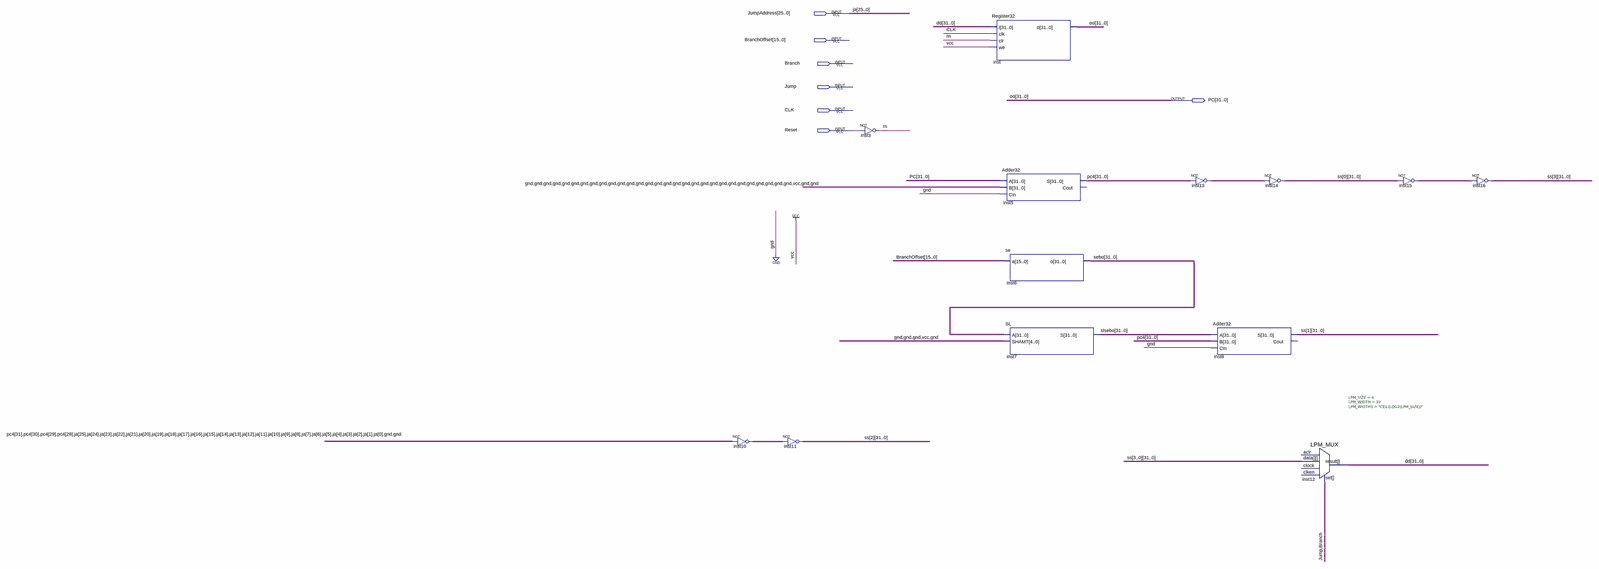
[diagram p0: schematic sheet, whole]
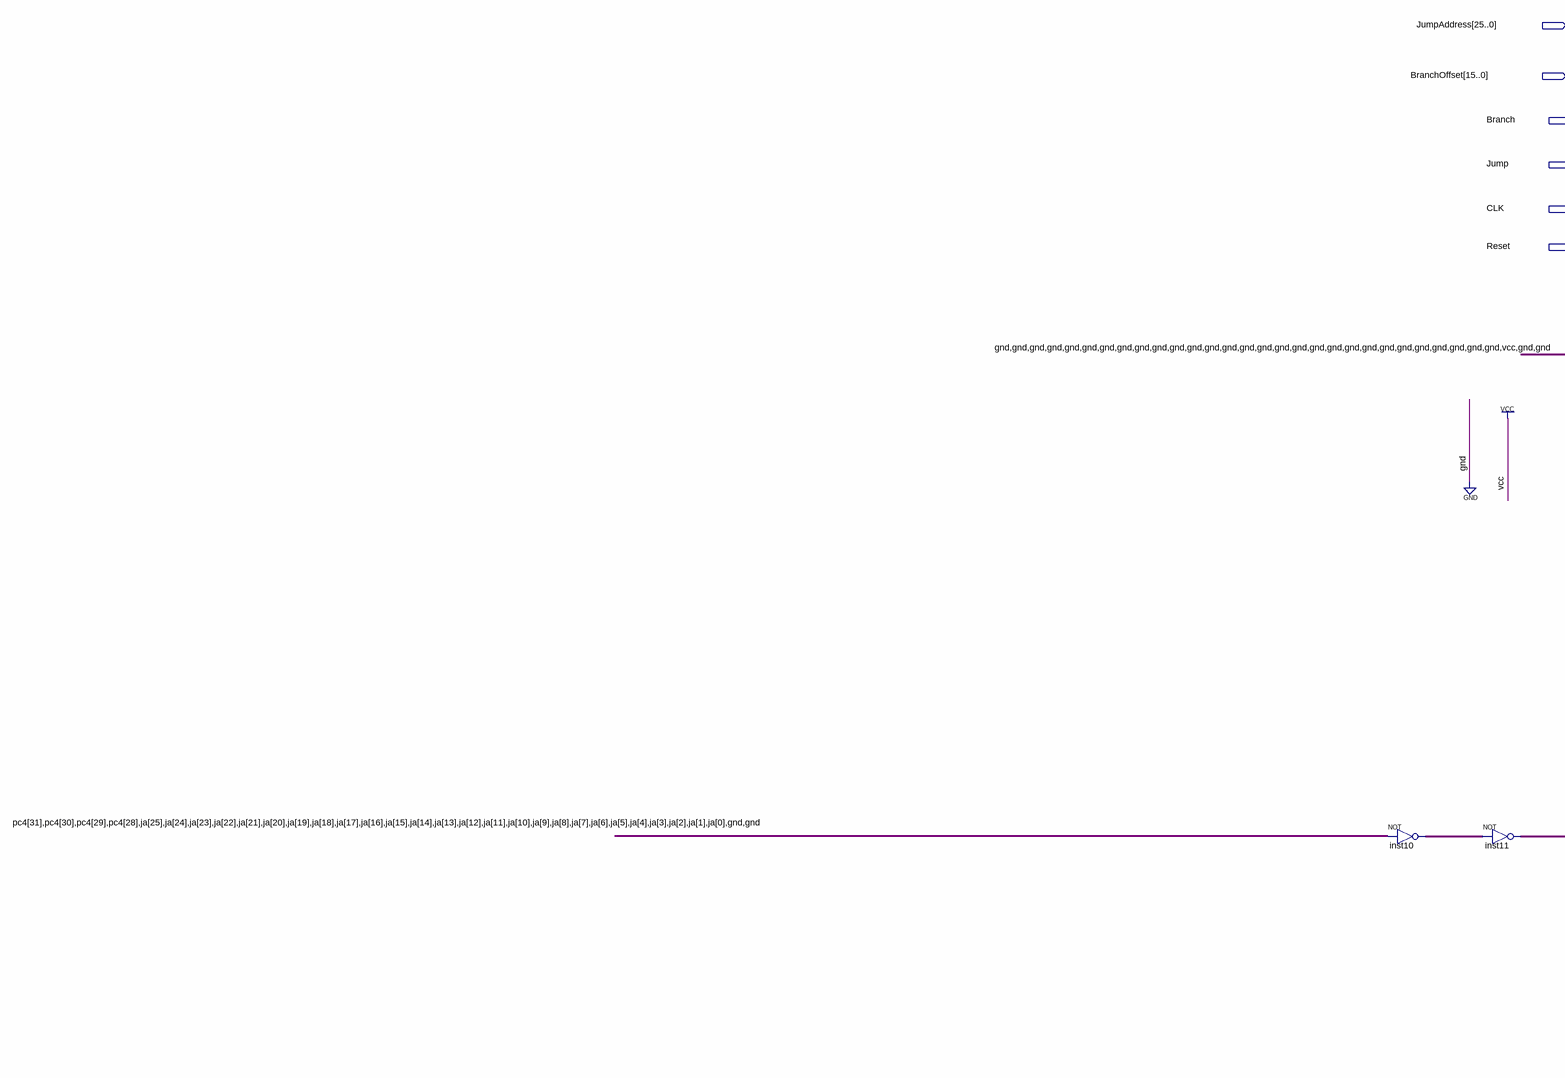
[diagram p1: schematic sheet, left part]
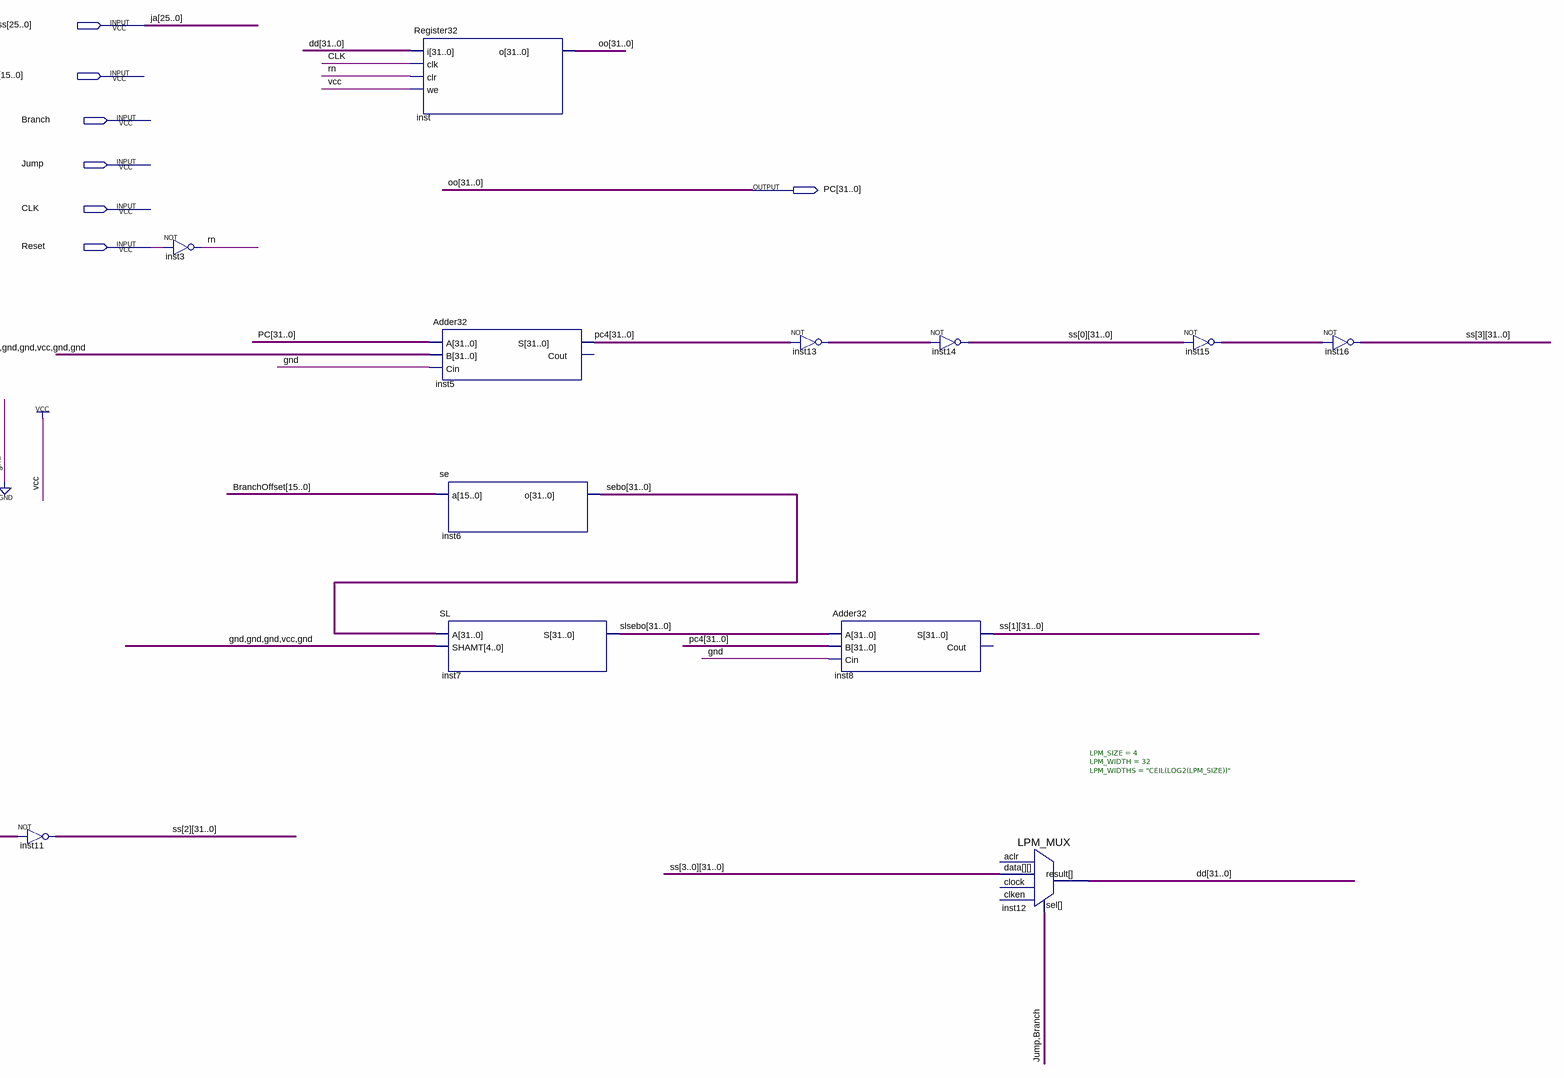
[diagram p2: schematic sheet, right part]
// Quartus schematic PC.bdf as structural Verilog: 13 symbols, 7 pins
module PC (
  input  [25:0] JumpAddress,
  input  [15:0] BranchOffset,
  input  Branch,
  input  Jump,
  input  CLK,
  input  Reset,
  output [31:0] PC
);

  wire rn;
  wire [31:0] dd, inst10_out, inst13_out, inst15_out, pc4, sebo, slsebo, ss_0, ss_1, ss_2, ss_3;

  assign inst10_out = ~{pc4[31:28], JumpAddress, 2'b00};  // NOT inst10, 32 bits wide
  assign ss_2 = ~inst10_out;  // NOT inst11, 32 bits wide
  not inst3 (rn, Reset);
  Register32 inst (.i(dd), .clk(CLK), .clr(rn), .we(1'b1), .o(PC));
  Adder32 inst5 (.A(PC), .B(32'b00000000000000000000000000000100), .Cin(1'b0), .S(pc4));  // open: Cout
  se inst6 (.a(BranchOffset), .o(sebo));
  SL inst7 (.A(sebo), .SHAMT(5'b00010), .S(slsebo));
  assign inst13_out = ~pc4;  // NOT inst13, 32 bits wide
  Adder32 inst8 (.A(slsebo), .B(pc4), .Cin(1'b0), .S(ss_1));  // open: Cout
  assign ss_0 = ~inst13_out;  // NOT inst14, 32 bits wide
  LPM_MUX #(.LPM_SIZE(4), .LPM_WIDTH(32), .LPM_WIDTHS("CEIL(LOG2(LPM_SIZE))")) inst12 (
    .data({ss_3, ss_2, ss_1, ss_0}), .sel({Jump, Branch}), .result(dd));  // open: clock, aclr, clken
  assign inst15_out = ~ss_0;  // NOT inst15, 32 bits wide
  assign ss_3 = ~inst15_out;  // NOT inst16, 32 bits wide

  // Other names for the same wires on the sheet: ja[25:0] = JumpAddress; oo[31:0] = PC
endmodule
